# EAGLE schematic opaq_n1 (EAGLE 6.3)

## Sheet 1 of 2
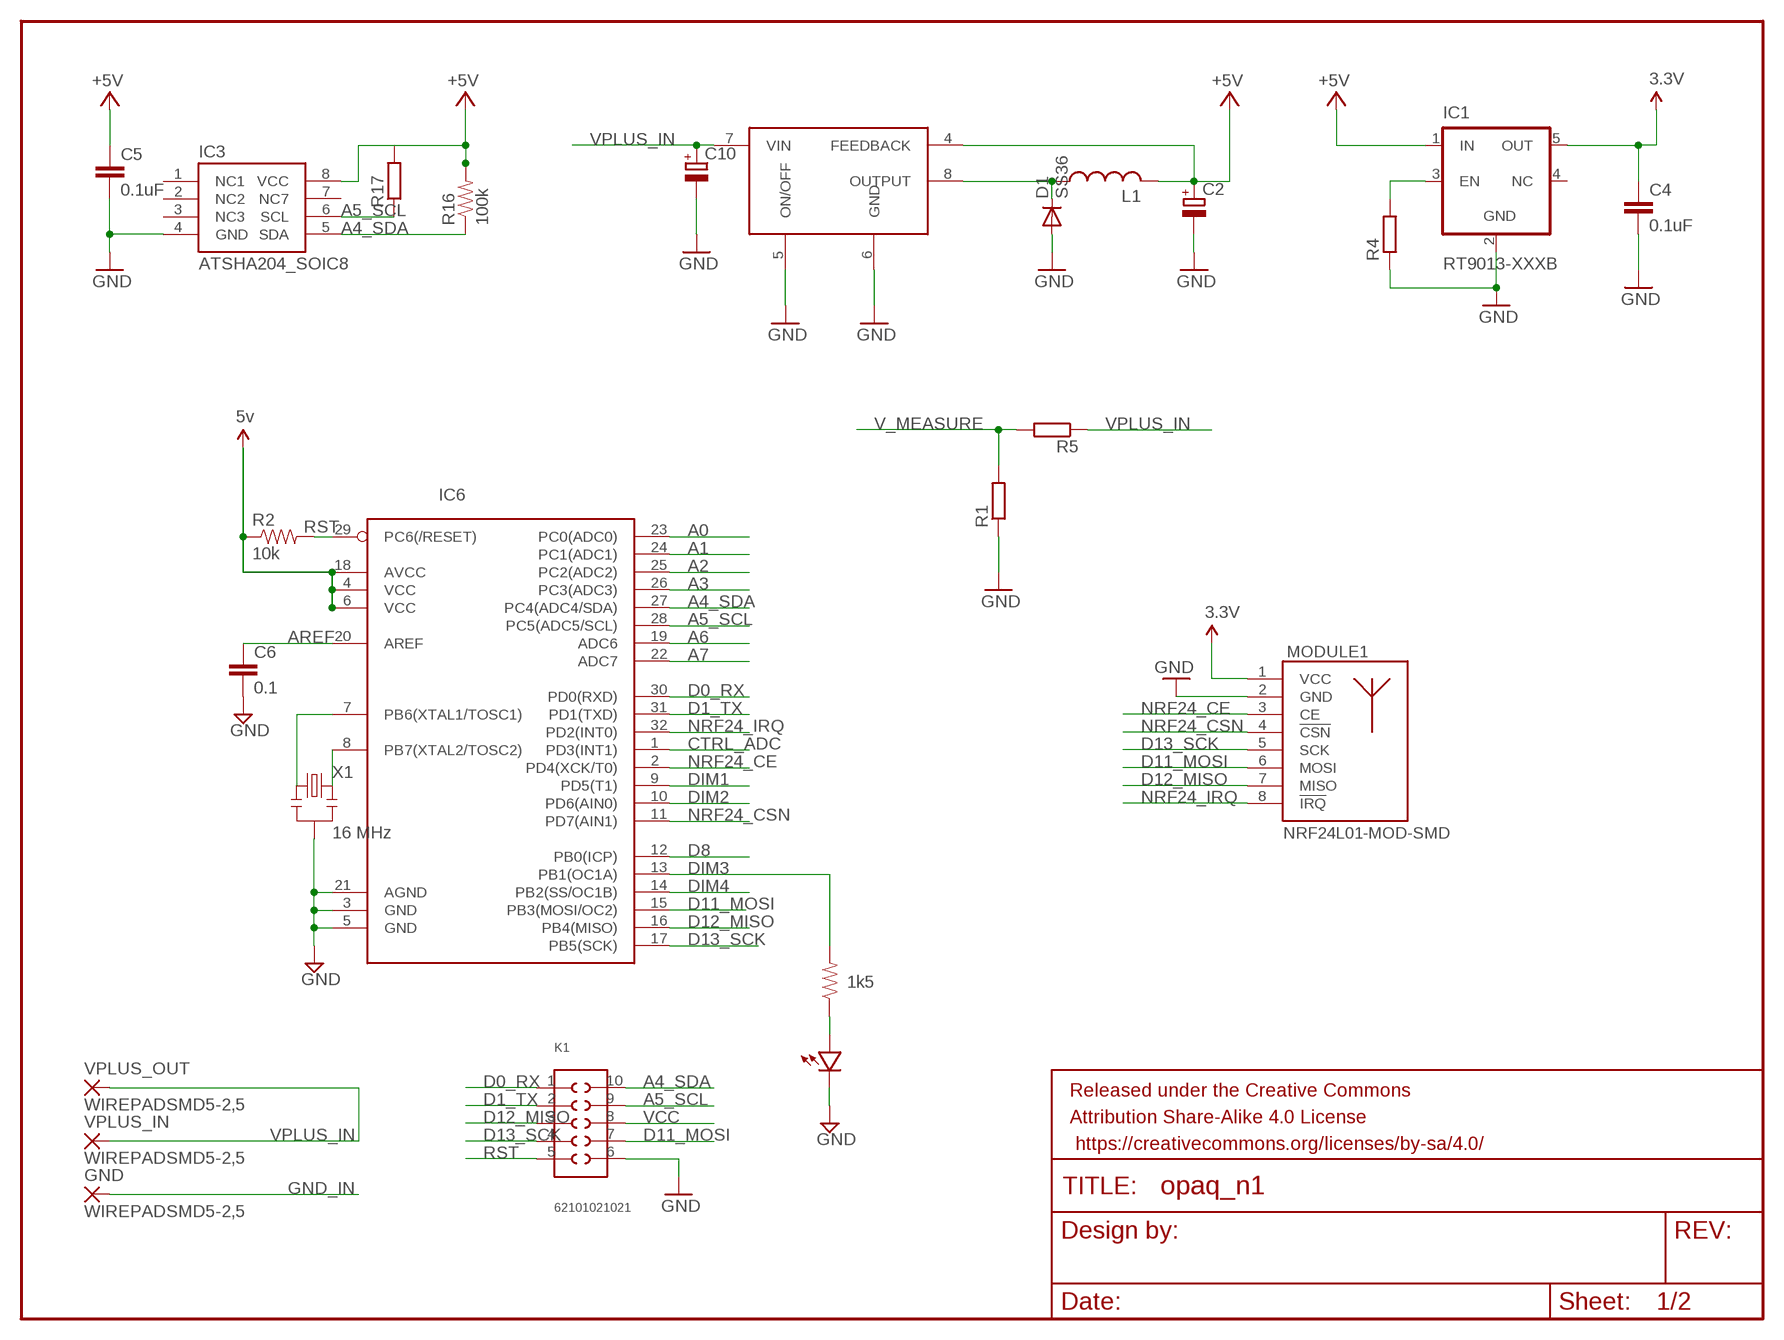
[diagram p0: schematic, sheet 1]

### Parts
C2  CPOL-EUC/6032-28R  [C/6032-28R]
C4  0.1uF  CAP0805  [0805]
C5  0.1uF  CAP0805  [0805]
C6  0.1  CAP0603-CAP  [0603-CAP]
C10  CPOL-EUD/7343-31R  [D/7343-31R]
D1  SS36  DIODESMA  [SMA-DIODE]
DIM  LED0603  [0603-LED]
FRAME1  FRAME-LETTER  [CREATIVE_COMMONS]
GND  WIREPADSMD5-2,5  [5-2,5]
IC1  RT9013-XXXB  [SOT23-5]
IC3  ATSHA204_SOIC8  [SOIC8]
IC6  ATMega-328  ATMEGA168/328MLF  [MLF32]
IC8  LM2594HV  LM2594  [SO08]
K1  62101021021  [62101021021]
L1  NR6045  [2525]
MODULE1  NRF24L01-MOD-SMD  [SMD8-MODULE]
R1  R-EU_R0805  [0805]
R2  10k  RESISTOR0603-RES  [0603-RES]
R3  1k5  RESISTOR0603-RES  [0603-RES]
R4  R-EU_R0805  [0805]
R5  R-EU_R0805  [0805]
R16  100k  RESISTOR0805-RES  [0805]
R17  R-EU_R0805  [0805]
VPLUS_IN  WIREPADSMD5-2,5  [5-2,5]
VPLUS_OUT  WIREPADSMD5-2,5  [5-2,5]
X1  16 MHz  RESONATORSMD  [RESONATOR-SMD]

### Nets
3.3V: C4.1 IC1.5(OUT) MODULE1.1(VCC)
+5V [power usb]: C2.+ C5.1 IC1.1(IN) IC3.8(VCC) IC8.4(FEEDBACK) L1.P$1 R16.2 R17.2 ; also sheet 2
A0: IC6.23(PC0(ADC0))
A1: IC6.24(PC1(ADC1))
A2: IC6.25(PC2(ADC2))
A3: IC6.26(PC3(ADC3))
A4_SDA: IC3.5(SDA) IC6.27(PC4(ADC4/SDA)) K1.10 R16.1 ; also sheet 2
A5_SCL: IC3.6(SCL) IC6.28(PC5(ADC5/SCL)) K1.9 R17.1 ; also sheet 2
A6: IC6.19(ADC6)
A7: IC6.22(ADC7)
AREF: C6.1 IC6.20(AREF)
CTRL_ADC: IC6.1(PD3(INT1)) ; also sheet 2
D0_RX: IC6.30(PD0(RXD)) K1.1
D1_TX: IC6.31(PD1(TXD)) K1.2
D8: IC6.12(PB0(ICP)) ; also sheet 2
D11_MOSI: IC6.15(PB3(MOSI/OC2)) K1.7 MODULE1.6(MOSI) ; also sheet 2
D12_MISO: IC6.16(PB4(MISO)) K1.3 MODULE1.7(MISO) ; also sheet 2
D13_SCK: IC6.17(PB5(SCK)) K1.4 MODULE1.5(SCK) ; also sheet 2
DIM1: IC6.9(PD5(T1)) ; also sheet 2
DIM2: IC6.10(PD6(AIN0)) ; also sheet 2
DIM3: IC6.13(PB1(OC1A)) R3.2 ; also sheet 2
DIM4: IC6.14(PB2(SS/OC1B)) ; also sheet 2
GND: C2.- C4.2 C5.2 C6.2 C10.- D1.A DIM.MINUS IC1.2(GND) IC3.4(GND) IC6.3(GND) IC6.5(GND) IC6.21(AGND) IC8.5(ON/OFF) IC8.6(GND) K1.6 MODULE1.2(GND) R1.1 R4.1 X1.2 ; also sheet 2
GND_IN: GND.1(P) ; also sheet 2
N$1: IC6.7(PB6(XTAL1/TOSC1)) X1.1
N$2: DIM.PLUS R3.1
N$10: IC1.3(EN) R4.2
N$17: D1.C IC8.8(OUTPUT) L1.P$2
N$21: IC6.8(PB7(XTAL2/TOSC2)) X1.3
NRF24_CE: IC6.2(PD4(XCK/T0)) MODULE1.3(CE)
NRF24_CSN: IC6.11(PD7(AIN1)) MODULE1.4(!CSN)
NRF24_IRQ: IC6.32(PD2(INT0)) MODULE1.8(!IRQ)
RST: IC6.29(PC6(/RESET)) K1.5 R2.2
V_MEASURE: R1.2 R5.2 ; also sheet 2
VCC: IC6.4(VCC) IC6.6(VCC) IC6.18(AVCC) K1.8 R2.1 ; supply symbol labelled 5v ; also sheet 2
VPLUS_IN [power]: C10.+ IC8.7(VIN) R5.1 VPLUS_IN.1(P) VPLUS_OUT.1(P)
Unconnected: IC1.4(NC) IC3.1(NC1) IC3.2(NC2) IC3.3(NC3) IC3.7(NC7)

## Sheet 2 of 2
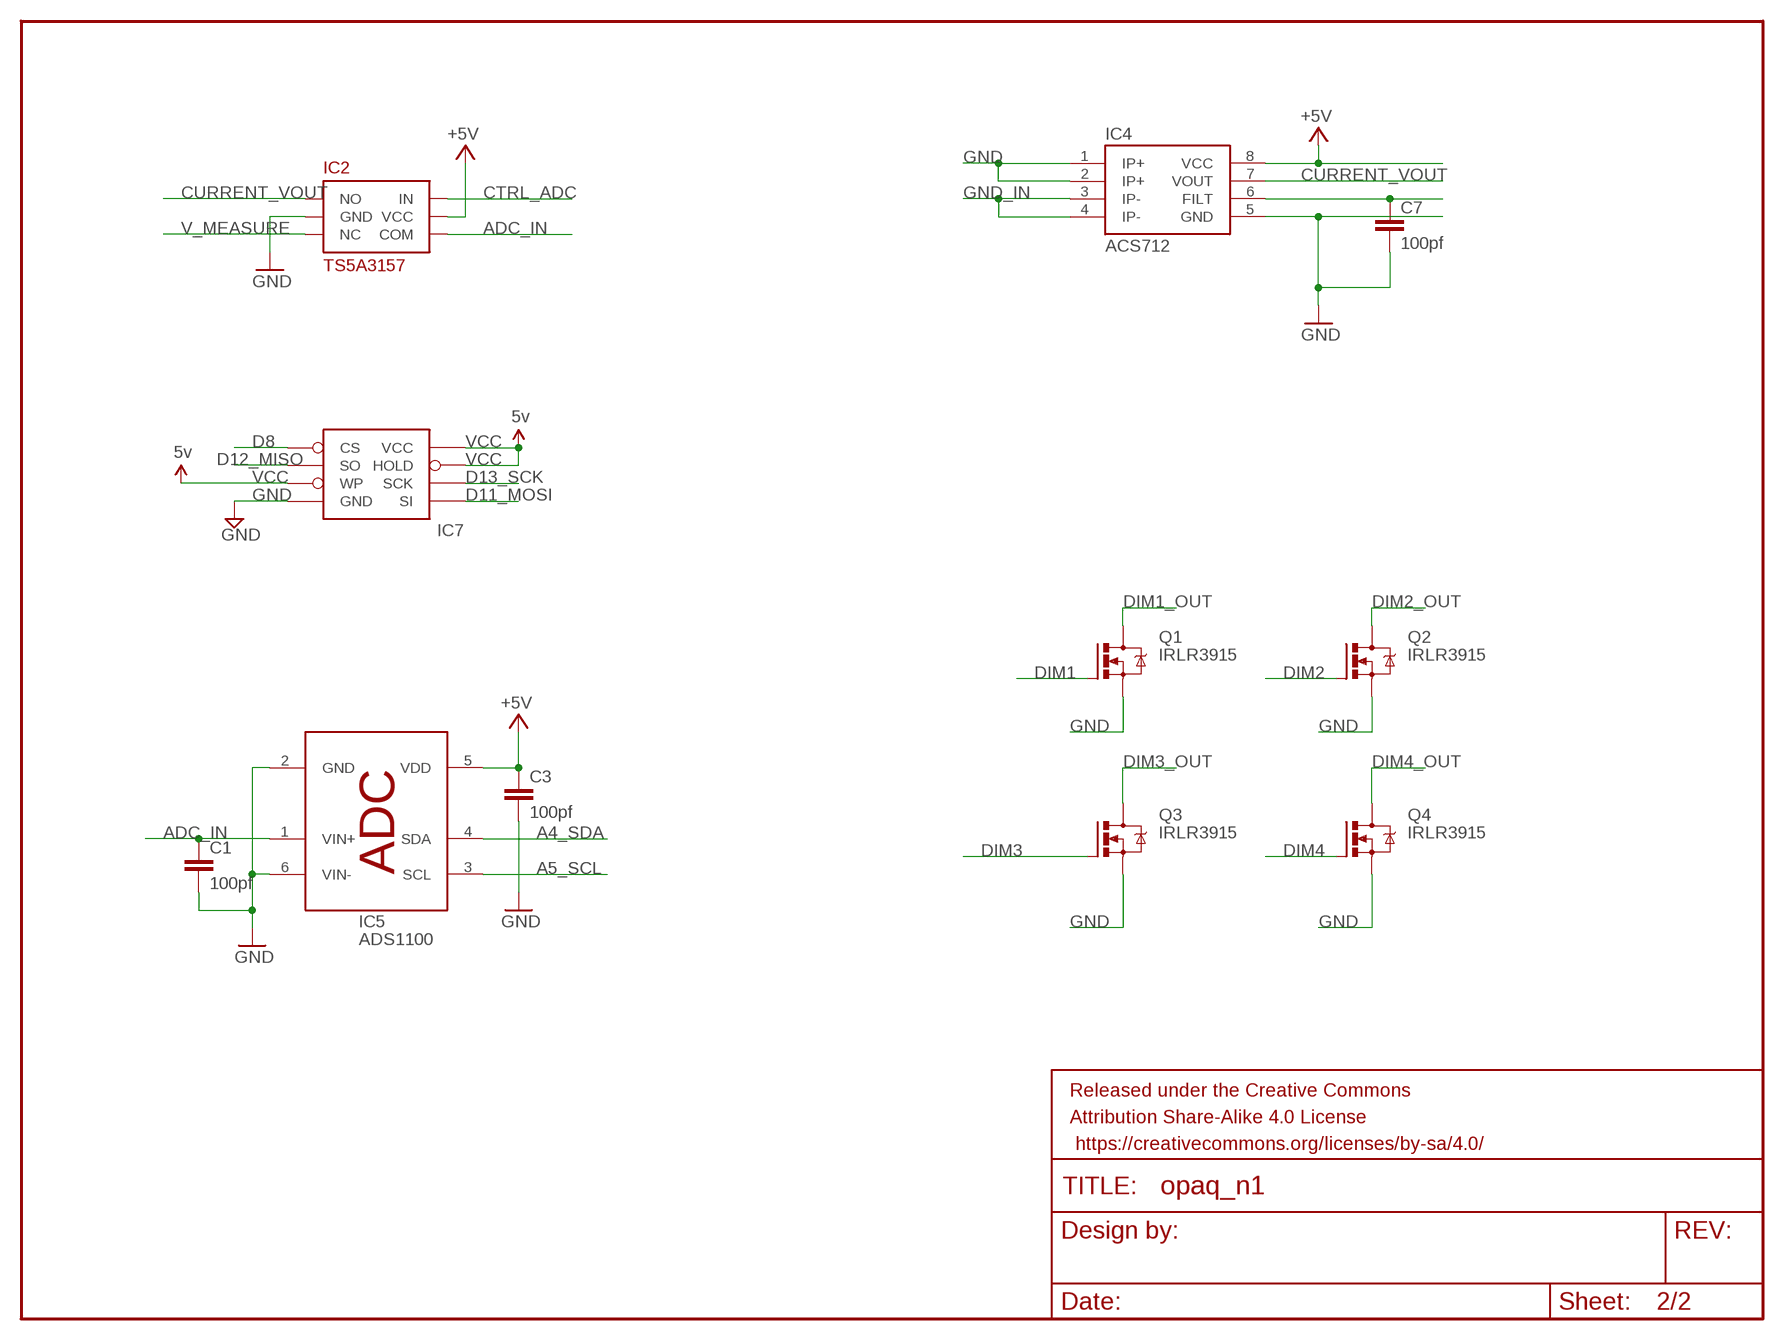
[diagram p1: schematic, sheet 2]

### Parts
C1  100pf  CAP0402-CAP  [0402-CAP]
C3  100pf  CAP0402-CAP  [0402-CAP]
C7  100pf  CAP0402-CAP  [0402-CAP]
FRAME2  FRAME-LETTERNO_PACKAGE  [DUMMY]
IC2  TS5A3157  [SOT23-6]
IC4  ACS712  [SO08]
IC5  ADS1100  [SOT23-6]
IC7  AT25F512BWIDE_5.3MM  [SO08WIDE]
Q1  IRLR3915  [D-PAK_TO252AA]
Q2  IRLR3915  [D-PAK_TO252AA]
Q3  IRLR3915  [D-PAK_TO252AA]
Q4  IRLR3915  [D-PAK_TO252AA]

### Nets
+5V [power usb]: C3.1 IC2.5(VCC) IC4.8(VCC) IC5.5(VDD) ; also sheet 1
A4_SDA: IC5.4(SDA) ; also sheet 1
A5_SCL: IC5.3(SCL) ; also sheet 1
ADC_IN: C1.1 IC2.4(COM) IC5.1(VIN+)
CTRL_ADC: IC2.6(IN) ; also sheet 1
CURRENT_VOUT: IC2.1(NO) IC4.7(VOUT)
D8: IC7.1(CS) ; also sheet 1
D11_MOSI: IC7.5(SI) ; also sheet 1
D12_MISO: IC7.2(SO) ; also sheet 1
D13_SCK: IC7.6(SCK) ; also sheet 1
DIM1: Q1.1(G) ; also sheet 1
DIM1_OUT: Q1.4(D)
DIM2: Q2.1(G) ; also sheet 1
DIM2_OUT: Q2.4(D)
DIM3: Q3.1(G) ; also sheet 1
DIM3_OUT: Q3.4(D)
DIM4: Q4.1(G) ; also sheet 1
DIM4_OUT: Q4.4(D)
FILT: C7.1 IC4.6(FILT)
GND: C1.2 C3.2 C7.2 IC2.2(GND) IC4.1(IP+) IC4.2(IP+) IC4.5(GND) IC5.2(GND) IC5.6(VIN-) IC7.4(GND) Q1.3(S) Q2.3(S) Q3.3(S) Q4.3(S) ; also sheet 1
GND_IN: IC4.3(IP-) IC4.4(IP-) ; also sheet 1
V_MEASURE: IC2.3(NC) ; also sheet 1
VCC: IC7.3(WP) IC7.7(HOLD) IC7.8(VCC) ; supply symbol labelled 5v ; also sheet 1

## Library data of the parts
C1 C3-C5 C7 = SparkFun-Passives:CAP: Capacitor Standard 0603 ceramic capacitor, and 0.1" leaded capacitor.
C2 C10 = rcl:CPOL-EU: POLARIZED CAPACITOR, European symbol
C6 = LowPowerLab:CAP: Capacitor Standard 0603 ceramic capacitor, and 0.1" leaded capacitor.
D1 = SparkFun:DIODE: Diode These are standard reverse protection diodes and small signal diodes. SMA package can handle up to about 1A. SOD-323 can handle about 200mA. What the SOD-323 package when ordering, there are some mfgs out there that are 5-pin packages.
DIM = LowPowerLab:LED
FRAME1 = SparkFun-Aesthetics:FRAME-LETTER: Schematic Frame Standard 8.5x11 US Letter frame
FRAME2 = SparkFun-Aesthetics:FRAME-LETTER: Schematic Frame Standard 8.5x11 US Letter frame; DESIGNER: Nobody; VERSION: v01
GND VPLUS_IN VPLUS_OUT = wirepad:WIREPAD: Wire PAD connect wire on PCB
IC1 = v-reg_extra:RT9013-XXX: LDO REGULATOR 500mA, Low Dropout, Low Noise Ultra-Fast without bypass capacitor CMOS LDO Regulator
IC2 = pimoroni:TS5A3157: TS5A3157: 10-Ω SPDT ANALOG SWITCH The TS5A3157 is a single-pole double-throw (SPDT) analog switch that is designed to operate from 1.65V to 5.5V. This device can handle both digital and analog signals, and signals up to V+ can be transmitted in either direction.
IC3 = SparkFun-DigitalIC:ATSHA204_SOIC8: ATSHA204; PROD_ID: IC-11981
IC4 = SparkFun:ACS712
IC5 = bytewerk-analog:ADS1100: 16-Bit ANALOG-TO-DIGITAL CONVERTER, I2C; MF: TI; MPN: ADS1100; OC_MOUSER: 595-ADS1100A1IDBVT
IC6 = LowPowerLab:ATMEGA168/328: Atmel 32-pin 8-bit micro, 16k flash.
IC7 = LowPowerLab:AT25F512B: 4-Mbit SPI flash memory
IC8 = apedro_lib:LM2594: 8-SOIC NMOSFET
K1 = Wurth_Elektronik_Electromechanic_Board_to_Board_Connectors_rev15c:62101021021: WR-PHD 1.27mm Dual SMT Pin Header H=3.80 mm, 10 Pins=>Code : Con_BTB_PHD_1.27_2_62101021021 <http://katalog.we-online.de/media/thumbs2/eican/thb_Con_BTB_PHD_1.27_2_6210xx21021_pf2.jpg> Details see: http://katalog.we-online.de/en/em/621_0xx_210_21 Created 2014-06-03, Karrer Zheng 2014 (C) Würth Elektronik
L1 = apedro_lib:NR6045
MODULE1 = nrf24l01:NRF24L01-MOD: NRF24L01 based module VCC = 1.9~3.6V
Q1-Q4 = apedro_lib:IRLR3915: N-Channel HEXFET® Power MOSFET Logic Level AUTOMOTIVE MOSFET Source: http://www.irf.com/product-info/datasheets/data/irlz44zpbf.pdf
R1 R4 R5 R17 = resistor:R-EU_: RESISTOR, European symbol
R2 R3 = LowPowerLab:RESISTOR: Resistor Basic schematic elements and footprints for 0603, 1206, and PTH resistors.
R16 = SparkFun-Passives:RESISTOR: Resistor Basic schematic elements and footprints for 0603, 1206, and PTH resistors.
X1 = SparkFun:RESONATOR: Resonator Small SMD resonator. This is the itty bitty 10/20MHz resonators with built in caps. CSTCE10M0G55 and CSTCE20M0V53. Footprint has been reviewed closely but hasn't been tested yet.

## Net classes
1 power: width 0.381 mm, clearance 0.254 mm
2 gnd: width 0.305 mm, drill 0.406 mm, clearance 0.203 mm
3 power usb: width 0.508 mm, drill 0.406 mm, clearance 0.203 mm